# Altium schematic sheet 02_MCU.SchDoc
size A4; PageSetup: Record=PageOptions|CenterHorizontal=True|CenterVertical=True|PrintScale=0.97|XCorrection=1.00|YCorrection=1.00|PrintKind=0|BorderSize=5000000|LeftOffset=0|BottomOffset=0|Orientation=2|PaperLength=1000|PaperWidth=1000|Scale=100|PaperSource=7|PrintQuality=-4|MediaType=1|DitherType=10|PaperKind=A4|PrintScaleMode=1; DATA: 2015-08-03
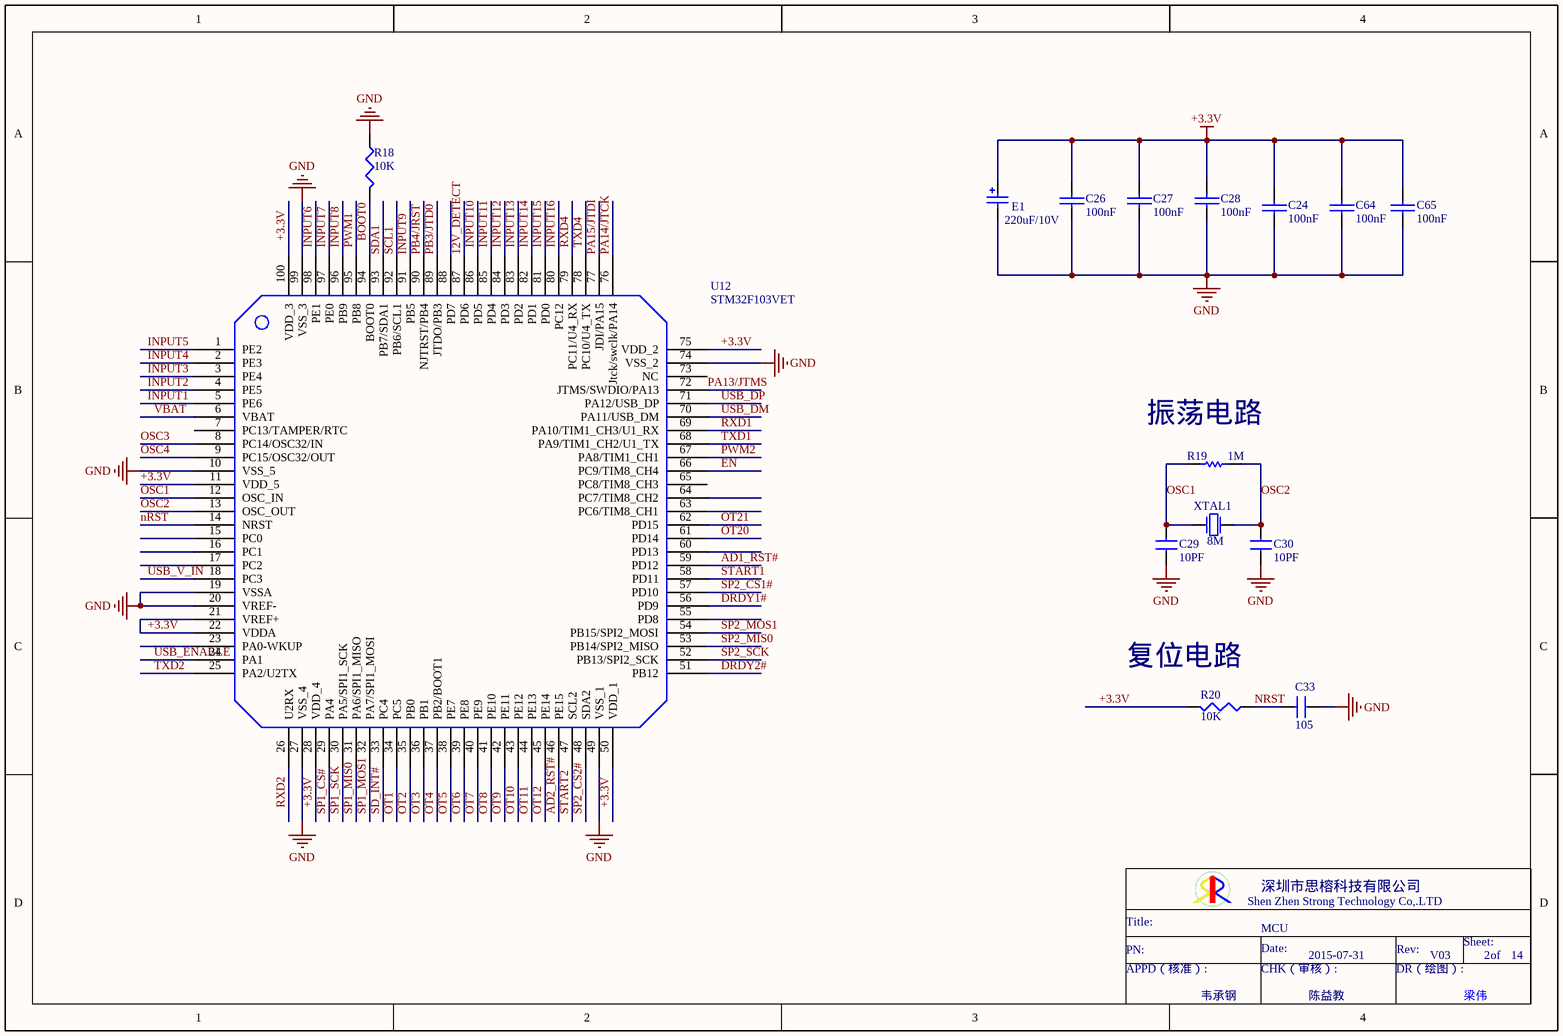
[diagram p0: 02_MCU.SchDoc]

## Parts
C24  100nF  [0603C]
C26  100nF  [0603C]
C27  100nF  [0603C]
C28  100nF  [0603C]
C29  10PF  [0603C]
C30  10PF  [0603C]
C33  value 105  [0603C]  (hidden comment: 100nF)
C64  100nF  [0603C]
C65  100nF  [0603C]
E1  220uF/10V  [6032]
R18  10K  [0603R]
R19  1M  [0603R]
R20  10K  [0603R]
U12  STM32F103VET  [LQFP100]
XTAL1  8M  [CRYL3*5]

## Nets
+3.3V: C24.2 C26.2 C27.2 C28.2 C64.2 C65.2 E1.1 R20.2 U12.11(VDD_5) U12.21(VREF+) U12.22(VDDA) U12.28(VDD_4) U12.50(VDD_1) U12.75(VDD_2) U12.100(VDD_3)
GND: C24.1 C26.1 C27.1 C28.1 C29.1 C30.1 C33.2 C64.1 C65.1 E1.2 R18.1 U12.10(VSS_5) U12.19(VSSA) U12.20(VREF-) U12.27(VSS_4) U12.49(VSS_1) U12.74(VSS_2) U12.99(VSS_3)
12V_DETECT: U12.87(PD6)
AD1_RST#: U12.59(PD12)
AD2_RST#: U12.46(PE15)
BOOT0: R18.2 U12.94(BOOT0)
DRDY1#: U12.56(PD9)
DRDY2#: U12.51(PB12)
EN: U12.66(PC9/TIM8_CH4)
INPUT1: U12.5(PE6)
INPUT2: U12.4(PE5)
INPUT3: U12.3(PE4)
INPUT4: U12.2(PE3)
INPUT5: U12.1(PE2)
INPUT6: U12.98(PE1)
INPUT7: U12.97(PE0)
INPUT8: U12.96(PB9)
INPUT9: U12.91(PB5)
INPUT10: U12.86(PD5)
INPUT11: U12.85(PD4)
INPUT12: U12.84(PD3)
INPUT13: U12.83(PD2)
INPUT14: U12.82(PD1)
INPUT15: U12.81(PD0)
INPUT16: U12.80(PC12)
nRST: C33.1 R20.1 U12.14(NRST)
OSC1: C29.2 R19.2 U12.12(OSC_IN) XTAL1.1
OSC2: C30.2 R19.1 U12.13(OSC_OUT) XTAL1.2
OSC3: U12.8(PC14/OSC32/IN)
OSC4: U12.9(PC15/OSC32/OUT)
OT1: U12.34(PC5)
OT2: U12.35(PB0)
OT3: U12.36(PB1)
OT4: U12.37(PB2/BOOT1)
OT5: U12.38(PE7)
OT6: U12.39(PE8)
OT7: U12.40(PE9)
OT8: U12.41(PE10)
OT9: U12.42(PE11)
OT10: U12.43(PE12)
OT11: U12.44(PE13)
OT12: U12.45(PE14)
OT20: U12.61(PD14)
OT21: U12.62(PD15)
PA13/JTMS: U12.72(JTMS/SWDIO/PA13)
PA14/JTCK: U12.76(Jtck/swclk/PA14)
PA15/JTDI: U12.77(JDI/PA15)
PB3/JTD0: U12.89(JTDO/PB3)
PB4/JRST: U12.90(NJTRST/PB4)
PWM1: U12.95(PB8)
PWM2: U12.67(PA8/TIM1_CH1)
RXD1: U12.69(PA10/TIM1_CH3/U1_RX)
RXD2: U12.26(U2RX)
RXD4: U12.79(PC11/U4_RX)
SCL1: U12.92(PB6/SCL1)
SD_INT#: U12.33(PC4)
SDA1: U12.93(PB7/SDA1)
SP1_CS#: U12.29(PA4)
SP1_MIS0: U12.31(PA6/SPI1_MISO)
SP1_MOS1: U12.32(PA7/SPI1_MOSI)
SP1_SCK: U12.30(PA5/SPI1_SCK)
SP2_CS1#: U12.57(PD10)
SP2_CS2#: U12.48(SDA2)
SP2_MIS0: U12.53(PB14/SPI2_MISO)
SP2_MOS1: U12.54(PB15/SPI2_MOSI)
SP2_SCK: U12.52(PB13/SPI2_SCK)
START1: U12.58(PD11)
START2: U12.47(SCL2)
TXD1: U12.68(PA9/TIM1_CH2/U1_TX)
TXD2: U12.25(PA2/U2TX)
TXD4: U12.78(PC10/U4_TX)
USB_DM: U12.70(PA11/USB_DM)
USB_DP: U12.71(PA12/USB_DP)
USB_ENABLE: U12.24(PA1)
USB_V_IN: U12.18(PC3)
VBAT: U12.6(VBAT)

Not connected (* = marked no-connect by the designer): U12 7(PC13/TAMPER/RTC) 15(PC0) 16(PC1) 17(PC2) 23(PA0-WKUP) 55(PD8) 60(PD13) 63(PC6/TIM8_CH1) 64(PC7/TIM8_CH2) 65(PC8/TIM8_CH3) 73(NC) 88(PD7)

## Notes on the sheet
- (near R19) 振荡电路
- (near R20) 复位电路
- MCU
- 2015-07-31
- V03
- 2
- 14
- 韦承钢
- 陈益教
- Shen Zhen Strong Technology Co,.LTD
- 深圳市思榕科技有限公司
- Title:
- PN:
- APPD（核准）:
- Date:
- CHK（审核）:
- DR（绘图）:
- Rev:
- Sheet:
- of
- 梁伟

## Library data of the parts
C24 C26-C28 C64 C65 = CAP
C29 C30 C33 = 电容: Capacitor
  C29 C30: Value: 10PF
E1 = 电解电容: Bi-Polar Capacitor; Value: 220uF/10V
R18 R20 = RES1
R19 = RES
U12 = STM32F103VET_1
XTAL1 = 晶振: CRYSTAL